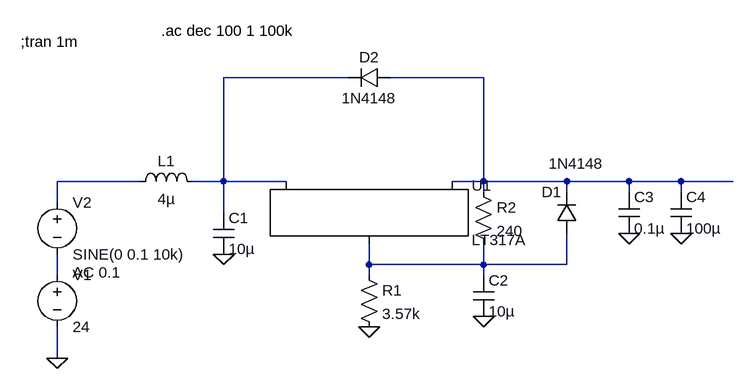
[diagram p0: schematic DC reg sim.asc]
DC reg sim.asc, the LTspice schematic file:
Version 4
SHEET 1 880 680
WIRE 160 -64 -32 -64
WIRE 368 -64 224 -64
WIRE -160 96 -288 96
WIRE -32 96 -32 -64
WIRE -32 96 -80 96
WIRE 64 96 -32 96
WIRE 368 96 368 -64
WIRE 368 96 320 96
WIRE 496 96 368 96
WIRE 592 96 496 96
WIRE 672 96 592 96
WIRE 752 96 672 96
WIRE 368 112 368 96
WIRE 496 112 496 96
WIRE 592 112 592 96
WIRE 672 112 672 96
WIRE -288 128 -288 96
WIRE -32 144 -32 96
WIRE 192 224 192 192
WIRE 368 224 368 192
WIRE 368 224 192 224
WIRE 496 224 496 176
WIRE 496 224 368 224
WIRE -288 240 -288 208
WIRE 192 240 192 224
WIRE 368 240 368 224
WIRE -288 368 -288 320
FLAG -32 208 0
FLAG -288 368 0
FLAG 192 320 0
FLAG 368 304 0
FLAG 592 176 0
FLAG 672 176 0
SYMBOL PowerProducts\\LT317A 192 96 R0
SYMATTR InstName U1
SYMBOL ind -176 112 R270
WINDOW 0 32 56 VTop 2
WINDOW 3 5 56 VBottom 2
SYMATTR InstName L1
SYMATTR Value 4µ
SYMBOL voltage -288 224 R0
WINDOW 123 0 0 Left 0
WINDOW 39 0 0 Left 0
SYMATTR InstName V1
SYMATTR Value 24
SYMBOL cap -48 144 R0
SYMATTR InstName C1
SYMATTR Value 10µ
SYMATTR SpiceLine Rser=0.1
SYMBOL res 176 224 R0
SYMATTR InstName R1
SYMATTR Value 3.57k
SYMBOL cap 352 240 R0
SYMATTR InstName C2
SYMATTR Value 10µ
SYMBOL res 352 96 R0
SYMATTR InstName R2
SYMATTR Value 240
SYMBOL diode 512 176 R180
WINDOW 0 24 64 Left 2
WINDOW 3 -41 108 Left 2
SYMATTR InstName D1
SYMATTR Value 1N4148
SYMBOL diode 224 -80 R90
WINDOW 0 0 32 VBottom 2
WINDOW 3 32 32 VTop 2
SYMATTR InstName D2
SYMATTR Value 1N4148
SYMBOL cap 576 112 R0
SYMATTR InstName C3
SYMATTR Value 0.1µ
SYMBOL cap 656 112 R0
SYMATTR InstName C4
SYMATTR Value 100µ
SYMATTR SpiceLine Rser=0.1
SYMBOL voltage -288 112 R0
WINDOW 123 24 124 Left 2
WINDOW 39 0 0 Left 0
SYMATTR InstName V2
SYMATTR Value SINE(0 0.1 10k)
SYMATTR Value2 AC 0.1
TEXT -344 -119 Left 2 !;tran 1m
TEXT -128 -136 Left 2 !.ac dec 100 1 100k

The netlist it stands for:
* DC reg sim.asc
XU1 N004 N002 N001 LT317A
L1 N003 N001 4µ
V1 N005 0 24
C1 N001 0 10µ Rser=0.1
R1 N004 0 3.57k
C2 N004 0 10µ
R2 N002 N004 240
D1 N004 N002 1N4148
D2 N002 N001 1N4148
C3 N002 0 0.1µ
C4 N002 0 100µ Rser=0.1
V2 N003 N005 SINE(0 0.1 10k) AC 0.1
.model D D
.lib standard.dio
;tran 1m
.ac dec 100 1 100k
.lib LTC.lib
.backanno
.end